# Altium schematic sheet Sheet_1_2023-06-20.schdoc
size 294 x 182 mm
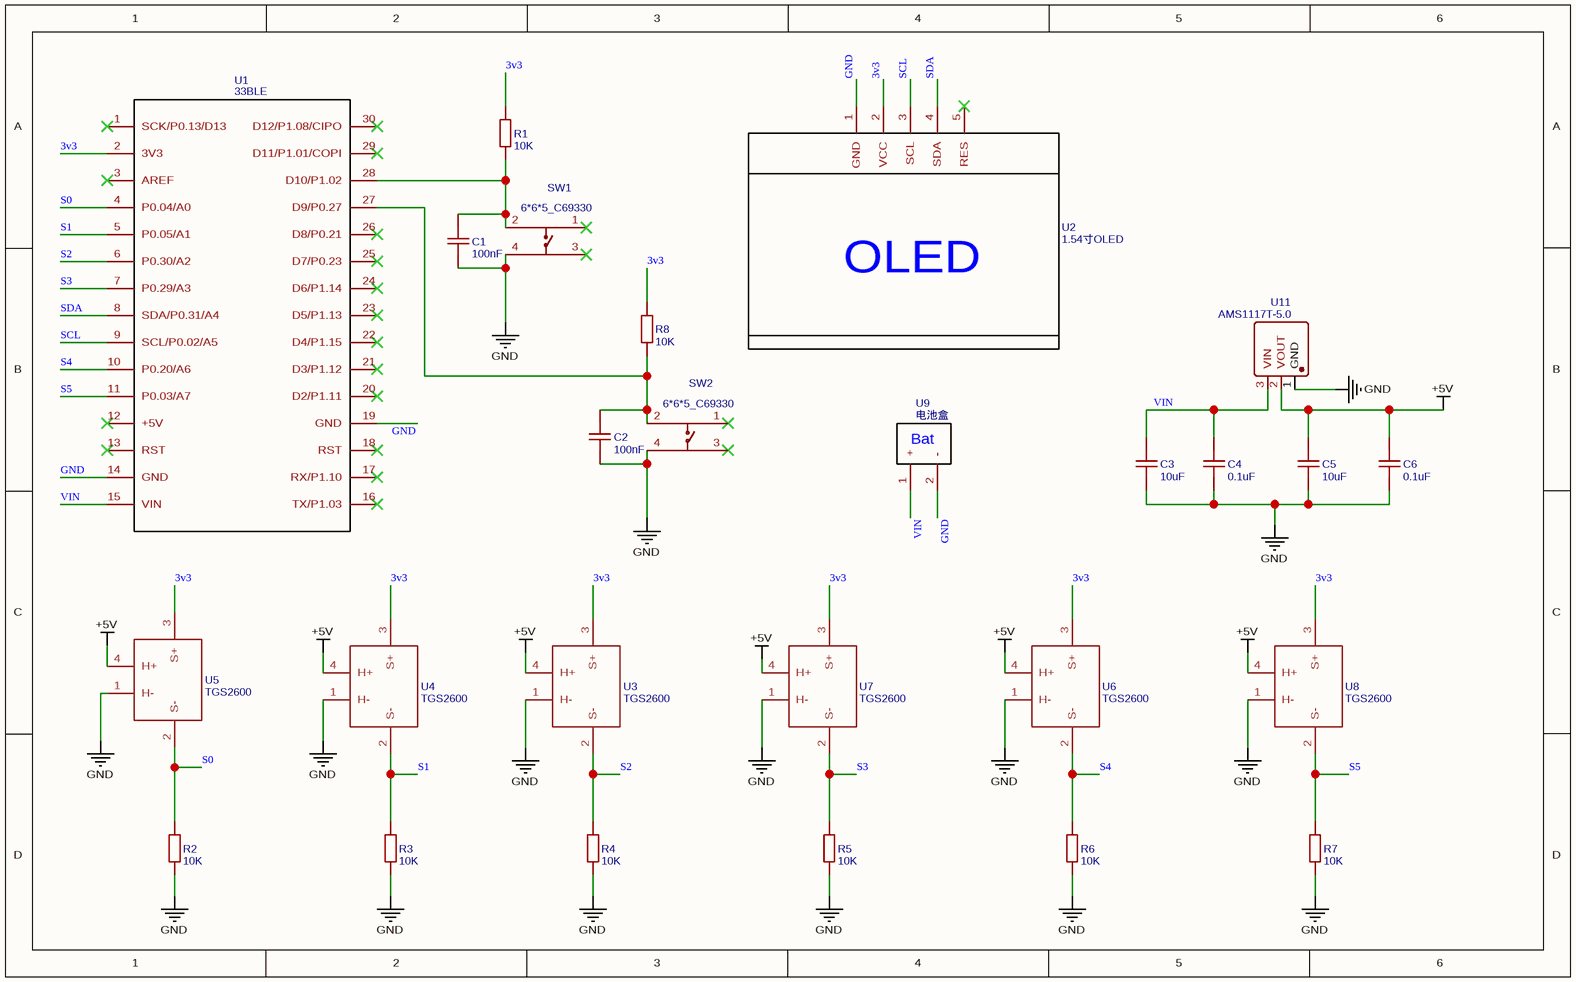
[diagram p0: Sheet_1_2023-06-20.schdoc]

## Parts
C1  100nF  [CAP-TH_L6.0-W2.5-P5.00-D1.0]
C2  100nF  [CAP-TH_L6.0-W2.5-P5.00-D1.0]
C3  10uF  [CAP-TH_L6.0-W2.5-P5.00-D1.0]
C4  0.1uF  [CAP-TH_L6.0-W2.5-P5.00-D1.0]
C5  10uF  [CAP-TH_L6.0-W2.5-P5.00-D1.0]
C6  0.1uF  [CAP-TH_L6.0-W2.5-P5.00-D1.0]
R1  10K  [RES-TH_BD3.3-L9.0-P13.00-D0.6]
R2  10K  [RES-TH_BD3.3-L9.0-P13.00-D0.6]
R3  10K  [RES-TH_BD3.3-L9.0-P13.00-D0.6]
R4  10K  [RES-TH_BD3.3-L9.0-P13.00-D0.6]
R5  10K  [RES-TH_BD3.3-L9.0-P13.00-D0.6]
R6  10K  [RES-TH_BD3.3-L9.0-P13.00-D0.6]
R7  10K  [RES-TH_BD3.3-L9.0-P13.00-D0.6]
R8  10K  [RES-TH_BD3.3-L9.0-P13.00-D0.6]
SW1  6*6*5_C69330  [SW-TH_4P-L6.1-W6.1-P4.50-LS6.3]
SW2  6*6*5_C69330  [SW-TH_4P-L6.1-W6.1-P4.50-LS6.3]
U1  33BLE  [33BLE]
U2  1.54寸OLED  [1.54寸OLED]
U3  TGS2600  [SENSOR-TH_TGS2600]
U4  TGS2600  [SENSOR-TH_TGS2600]
U5  TGS2600  [SENSOR-TH_TGS2600]
U6  TGS2600  [SENSOR-TH_TGS2600]
U7  TGS2600  [SENSOR-TH_TGS2600]
U8  TGS2600  [SENSOR-TH_TGS2600]
U9  电池盒  [电池盒]
U11  AMS1117T-5.0  [TO-220-3_L10.0-W4.5-P2.54-L]

## Nets
+5V: C5.2 C6.2 U3.4(H+) U4.4(H+) U5.4(H+) U6.4(H+) U7.4(H+) U8.4(H+) U11.2(VOUT)
GND: C1.1 C2.1 C3.1 C4.1 C5.1 C6.1 R2.1 R3.1 R4.1 R5.1 R6.1 R7.1 SW1.4 SW2.4 U1.14(GND) U1.19(GND) U2.1(GND) U3.1(H-) U4.1(H-) U5.1(H-) U6.1(H-) U7.1(H-) U8.1(H-) U9.2(-) U11.1(GND)
3v3: R1.2 R8.2 U1.2(3V3) U2.2(VCC) U3.3(S+) U4.3(S+) U5.3(S+) U6.3(S+) U7.3(S+) U8.3(S+)
S0: R2.2 U1.4(P0.04/A0) U5.2(S-)
S1: R3.2 U1.5(P0.05/A1) U4.2(S-)
S2: R4.2 U1.6(P0.30/A2) U3.2(S-)
S3: R5.2 U1.7(P0.29/A3) U7.2(S-)
S4: R6.2 U1.10(P0.20/A6) U6.2(S-)
S5: R7.2 U1.11(P0.03/A7) U8.2(S-)
SCL: U1.9(SCL/P0.02/A5) U2.3(SCL)
SDA: U1.8(SDA/P0.31/A4) U2.4(SDA)
VIN: C3.2 C4.2 U1.15(VIN) U9.1(+) U11.3(VIN)
NetC1_2: C1.2 R1.1 SW1.2 U1.28(D10/P1.02)
NetC2_2: C2.2 R8.1 SW2.2 U1.27(D9/P0.27)

Not connected (* = marked no-connect by the designer): SW1 1* 3*; SW2 1* 3*; U1 1(SCK/P0.13/D13)* 3(AREF)* 12(+5V)* 13(RST)* 16(TX/P1.03)* 17(RX/P1.10)* 18(RST)* 20(D2/P1.11)* 21(D3/P1.12)* 22(D4/P1.15)* 23(D5/P1.13)* 24(D6/P1.14)* 25(D7/P0.23)* 26(D8/P0.21)* 29(D11/P1.01/COPI)* 30(D12/P1.08/CIPO)*; U2 5(RES)*

## Notes on the sheet
- (in symbol 1.54寸OLED) OLED
- (in symbol 电池盒) Bat

## Library data of the parts
C1 C2 = 100nF: BOM_Manufacturer: STE(松田); BOM_Manufacturer Part: F06F1B104MQ0T0SHN0; nameAlias: Capacitance; Contributor: LCSC; BOM_Supplier: LCSC; BOM_Supplier Part: C366739; BOM_JLCPCB Part Class: Extended Part; spicePre: C; spiceSymbolName: F06F1B104MQ0T0SHN0
C3 C5 = 10uF: BOM_Manufacturer: STE(松田); BOM_Manufacturer Part: F06F1B104MQ0T0SHN0; nameAlias: Capacitance; Contributor: LCSC; BOM_Supplier: LCSC; BOM_Supplier Part: C366739; BOM_JLCPCB Part Class: Extended Part; spicePre: C; spiceSymbolName: F06F1B104MQ0T0SHN0
C4 C6 = 0.1uF: BOM_Manufacturer: STE(松田); BOM_Manufacturer Part: F06F1B104MQ0T0SHN0; nameAlias: Capacitance; Contributor: LCSC; BOM_Supplier: LCSC; BOM_Supplier Part: C366739; BOM_JLCPCB Part Class: Extended Part; spicePre: C; spiceSymbolName: F06F1B104MQ0T0SHN0
R1-R8 = 10K: BOM_Manufacturer: YAGEO(国巨); BOM_Manufacturer Part: MFR1WSJT-52-10K; nameAlias: Resistance (Ohms); Contributor: LCSC; Resistance: 10kΩ; BOM_Supplier: LCSC; BOM_Supplier Part: C176401; BOM_JLCPCB Part Class: Extended Part; spicePre: R; spiceSymbolName: MFR1WSJT-52-10K
SW1 SW2 = 6*6*5_C69330: BOM_Manufacturer: null; BOM_Manufacturer Part: 6*6*5 直插环保260G 耐温复银; BOM_Supplier: LCSC; BOM_Supplier Part: C69330; BOM_JLCPCB Part Class: Extended Part; spicePre: S; spiceSymbolName: 6*6*5_C69330
U1 = 33BLE: BOM_Manufacturer: Arduino; Contributor: jlu_gty; spicePre: U; spiceSymbolName: 33BLE
U2 = 1.54寸OLED: Contributor: Guest; spicePre: U; spiceSymbolName: 1.54寸OLED
U3-U8 = TGS2600: BOM_Manufacturer: null; Contributor: LCSC; BOM_Supplier: LCSC; BOM_Supplier Part: C9900008686; BOM_Manufacturer Part: TGS2600; BOM_JLCPCB Part Class: Extended Part; spicePre: U; spiceSymbolName: TGS2600
U9 = 电池盒: Contributor: JLU_GTY; spicePre: U; spiceSymbolName: 电池盒
U11 = AMS1117T-5.0: BOM_Manufacturer: HGC(华冠); Contributor: LCSC; BOM_Supplier: LCSC; BOM_Supplier Part: C498134; BOM_Manufacturer Part: AMS1117T-5.0; BOM_JLCPCB Part Class: Extended Part; spicePre: U; spiceSymbolName: AMS1117T-5.0